# EAGLE design MCO_controller_V5 (EAGLE 7.1.0)
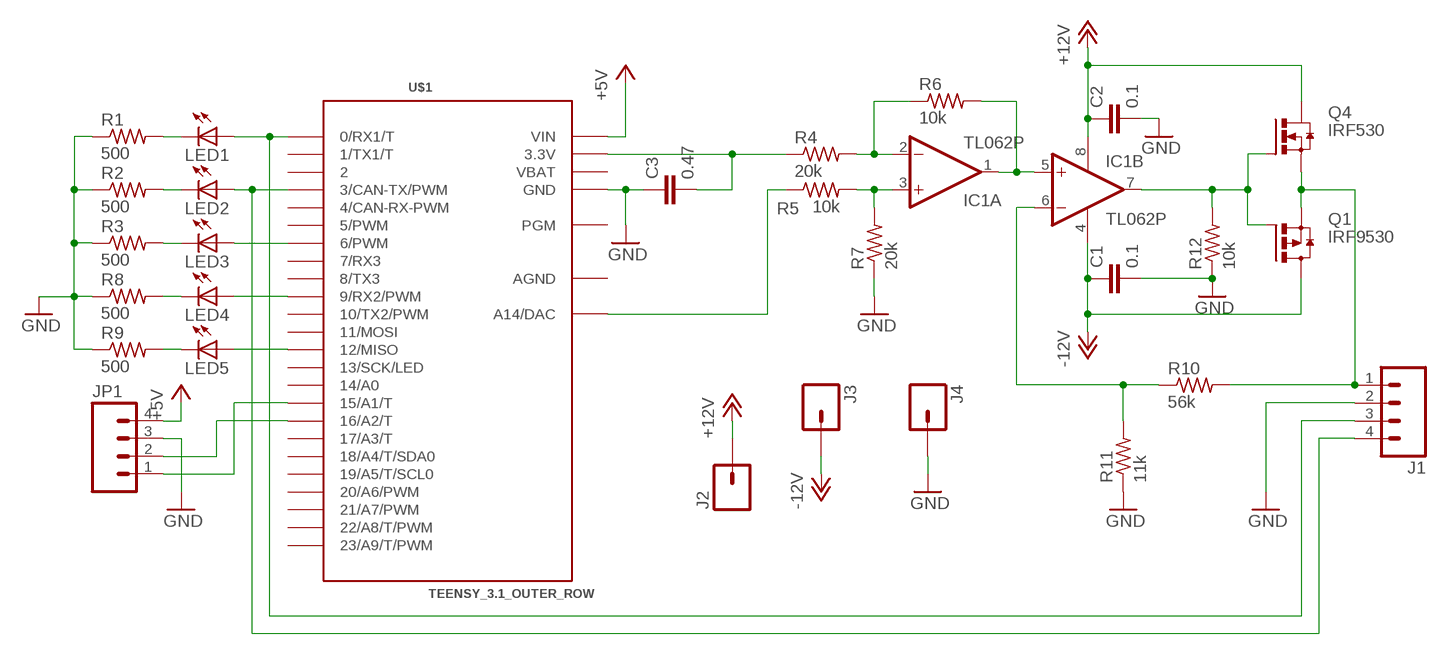
[diagram p0: schematic, sheet 1]

## Parts
C1  0.1  CAPPTH  [CAP-PTH-SMALL]
C2  0.1  CAPPTH  [CAP-PTH-SMALL]
C3  0.47  CAPPTH1  [CAP-PTH-5MM]
IC1  TL062P  [DIL08]
J1  M04SCREW  [SCREWTERMINAL-3.5MM-4]
J2  M01PTH_LONGPAD  [1X01_LONGPAD]
J3  M01PTH_LONGPAD  [1X01_LONGPAD]
J4  M01PTH_LONGPAD  [1X01_LONGPAD]
JP1  M04SCREW  [SCREWTERMINAL-3.5MM-4]
LED1  LED5MM  [LED5MM]
LED2  LED5MM  [LED5MM]
LED3  LED5MM  [LED5MM]
LED4  LED5MM  [LED5MM]
LED5  LED5MM  [LED5MM]
Q1  IRF9530  [TO220AV]
Q4  IRF530  [TO220AV]
R1  500  R-US_0207/10  [0207/10]
R2  500  R-US_0207/10  [0207/10]
R3  500  R-US_0207/10  [0207/10]
R4  20k  R-US_0207/10  [0207/10]
R5  10k  R-US_0207/10  [0207/10]
R6  10k  R-US_0207/10  [0207/10]
R7  20k  R-US_0207/10  [0207/10]
R8  500  R-US_0207/10  [0207/10]
R9  500  R-US_0207/10  [0207/10]
R10  56k  R-US_0207/10  [0207/10]
R11  11k  R-US_0207/10  [0207/10]
R12  10k  R-US_0207/10  [0207/10]
U$1  TEENSY_3.1_OUTER_ROW  [TEENSY3-OUTER_ROW]

## Nets
+5V: JP1.4 U$1.VIN
+12V: C2.1 IC1.8(P:V+) J2.1 Q4.C(D)
-12V: C1.1 IC1.4(P:V-) J3.1 Q1.C(D)
GND: C1.2 C2.2 C3.1 J1.2 J4.1 JP1.3 R1.1 R2.1 R3.1 R7.1 R8.1 R9.1 R11.1 R12.1 U$1.GND U$1.GND1(GND)
N$1: IC1.1(A:OUT) IC1.5(B:+IN) R6.2
N$2: IC1.2(A:-IN) R4.2 R6.1
N$3: IC1.3(A:+IN) R5.2 R7.2
N$4: C3.2 R4.1 U$1.3.3V U$1.3.3V1(3.3V)
N$5: IC1.7(B:OUT) Q1.B(G) Q4.B(G) R12.2
N$7: JP1.1 U$1.15/A1(15/A1/T)
N$8: R5.1 U$1.RESET/DAC(A14/DAC)
N$9: LED4.A U$1.9(9/RX2/PWM)
N$10: JP1.2 U$1.16/A2(16/A2/T)
N$11: LED1.K(C) R1.2
N$12: LED2.K(C) R2.2
N$13: LED3.K(C) R3.2
N$14: J1.4 LED2.A U$1.3(3/CAN-TX/PWM)
N$15: J1.3 LED1.A U$1.0(0/RX1/T)
N$16: LED3.A U$1.6(6/PWM)
N$17: LED4.K(C) R8.2
N$21: LED5.A U$1.12(12/MISO)
N$22: LED5.K(C) R9.2
N$23: J1.1 Q1.E(S) Q4.E(S) R10.2
N$24: IC1.6(B:-IN) R10.1 R11.2
Unconnected: U$1.1(1/TX1/T) U$1.2 U$1.4(4/CAN-RX-PWM) U$1.5(5/PWM) U$1.7(7/RX3) U$1.8(8/TX3) U$1.10(10/TX2/PWM) U$1.11(11/MOSI) U$1.13(13/SCK/LED) U$1.14/A0 U$1.17/A3(17/A3/T) U$1.18/A4(18/A4/T/SDA0) U$1.19/A5(19/A5/T/SCL0) U$1.20/A6(20/A6/PWM) U$1.21/A7(21/A7/PWM) U$1.22/A8(22/A8/T/PWM) U$1.23/A9(23/A9/T/PWM) U$1.PGM

## Power pins joined to a net without a drawn wire
AGND: U$1.AGND
VBAT: U$1.VBAT

## Library data of the parts
C1-C3 = SparkFun:CAP: Capacitor Standard 0603 ceramic capacitor, and 0.1" leaded capacitor.
IC1 = linear:TL062: OP AMP
J1 = SparkFun-Connectors:M04: Header 4 Standard 4-pin 0.1" header. Use with straight break away headers (SKU : PRT-00116), right angle break away headers (PRT-00553), swiss pins (PRT-00743), machine pins (PRT-00117), and female headers (PRT-00115). Molex polarized connector foot print use with SKU : PRT-08231 with associated ...
J2-J4 = SparkFun-Connectors:M01: Header 1 Standard 1-pin 0.1" header. Use with straight break away headers (SKU : PRT-00116), right angle break away headers (PRT-00553), swiss pins (PRT-00743), machine pins (PRT-00117), and female headers (PRT-00115).
JP1 = SparkFun:M04: Header 4 Standard 4-pin 0.1" header. Use with straight break away headers (SKU : PRT-00116), right angle break away headers (PRT-00553), swiss pins (PRT-00743), machine pins (PRT-00117), and female headers (PRT-00115). Molex polarized connector foot print use with SKU : PRT-08231 with associated ...
LED1-LED5 = adafruit:LED: LED OSRAM: - CHIPLED LG R971, LG N971, LY N971, LG Q971, LY Q971, LO R971, LY R971 LH N974, LH R974 LS Q976, LO Q976, LY Q976 LO Q996 - Hyper CHIPLED LW Q18S LB Q993, LB Q99A, LB R99A - SideLED LS A670, LO A670, LY A670, LG A670, LP A670 LB A673, LV A673, LT A673, LW A673 LH A674 LY A675 LS A676, LA A676, LO A676, LY A676, LW A676 LS A679, LY A679, LG A679 - Hyper Micro SIDELED® LS Y876, LA Y876, LO Y876, LY Y876 LT Y87S - SmartLED LW L88C, LW L88S LB L89C, LB L89S, LG L890 LS L89K, LO L89K, LY L89K LS L896, LA L896, LO L896, LY L896 - TOPLED LS T670, LO T670, LY T670, LG T670, LP T670 LSG T670, LSP T670, LSY T670, LOP T670, LYG T670 LG T671, LOG T671, LSG T671 LB T673, LV T673, LT T673, LW T673 LH T674 LS T676, LA T676, LO T676, LY T676, LB T676, LH T676, LSB T676, LW T676 LB T67C, LV T67C, LT T67C, LS T67K, LO T67K, LY T67K, LW E67C LS E67B, LA E67B, LO E67B, LY E67B, LB E67C, LV E67C, LT E67C LW T67C LS T679, LY T679, LG T679 LS T770, LO T770, LY T770, LG T770, LP T770 LB T773, LV T773, LT T773, LW T773 LH T774 LS E675, LA E675, LY E675, LS T675 LS T776, LA T776, LO T776, LY T776, LB T776 LHGB T686 LT T68C, LB T68C - Hyper Mini TOPLED® LB M676 - Mini TOPLED Santana® LG M470 LS M47K, LO M47K, LY M47K Source: http://www.osram.convergy.de/
Q1 = Ayars:IRF9530
Q4 = Ayars:IRF530
R1-R12 = resistor:R-US_: RESISTOR, American symbol
U$1 = Teensy_3_and_LC_Series_Boards_v1.0:TEENSY_3.1_OUTER_ROW: Footprint for Teensy 3.1 or 3.2 board using all pin connections on the outer perimeter

## Board
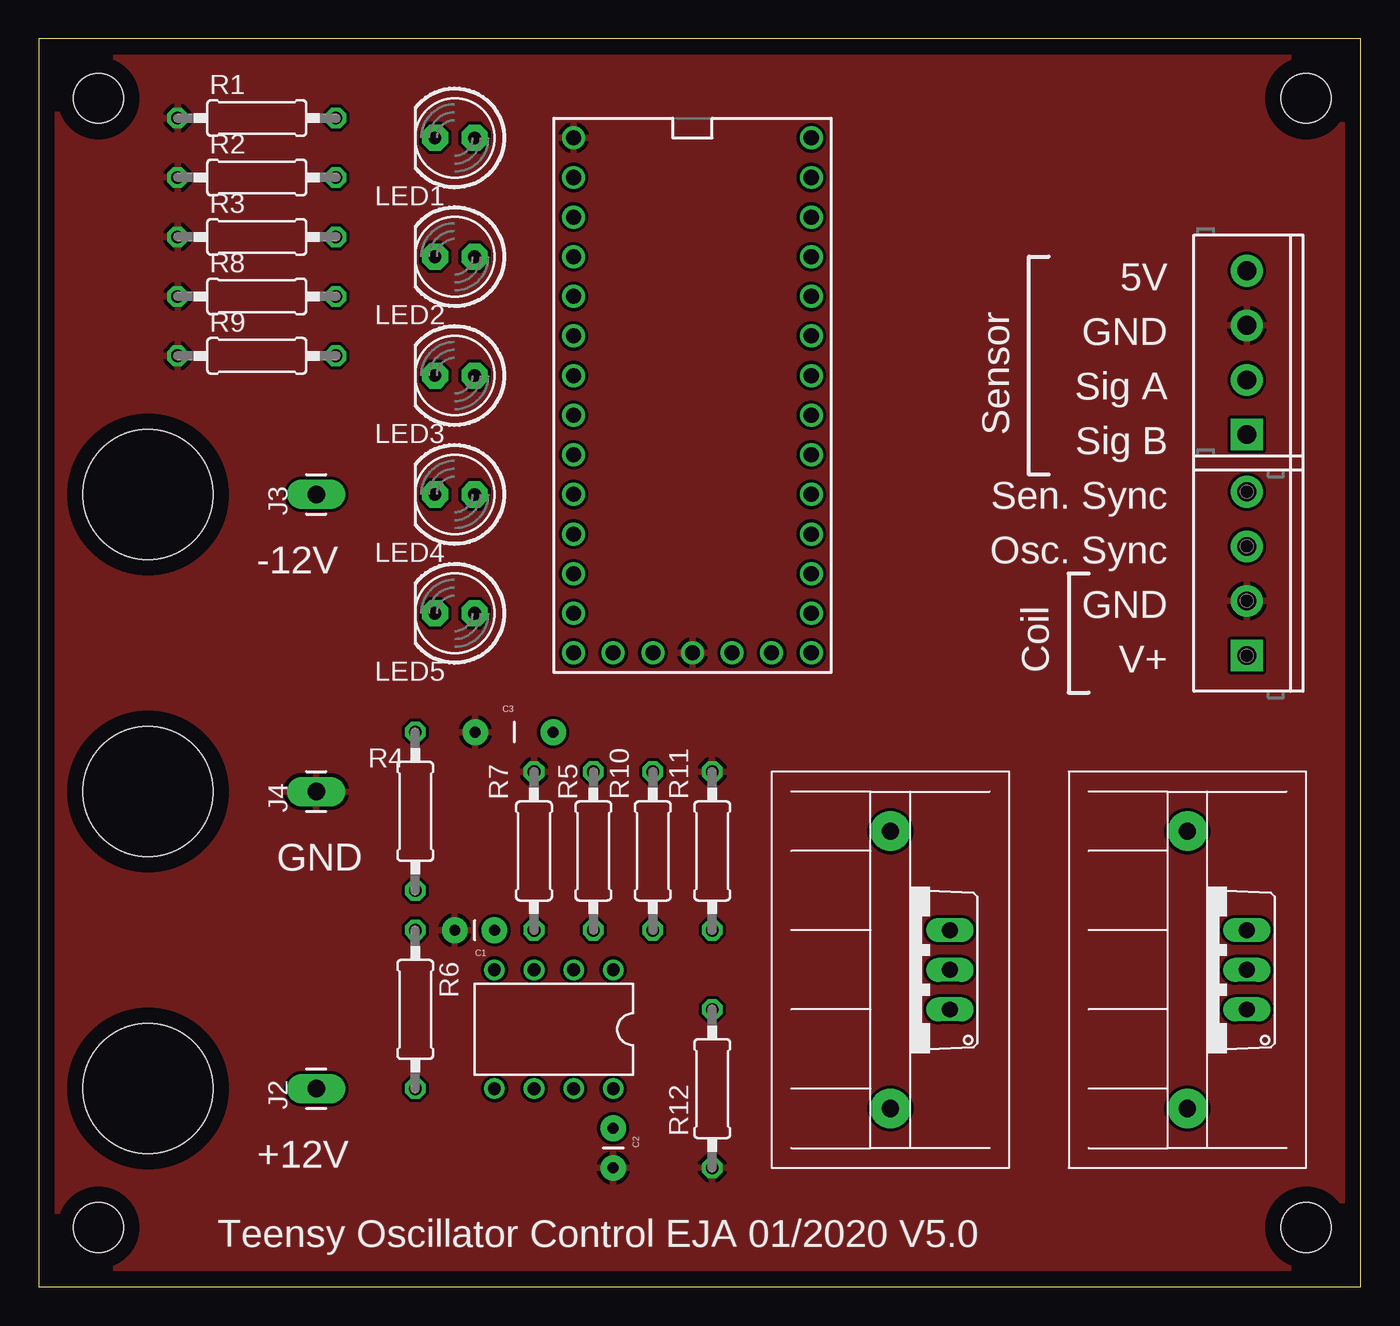
[diagram p1: board, top side]
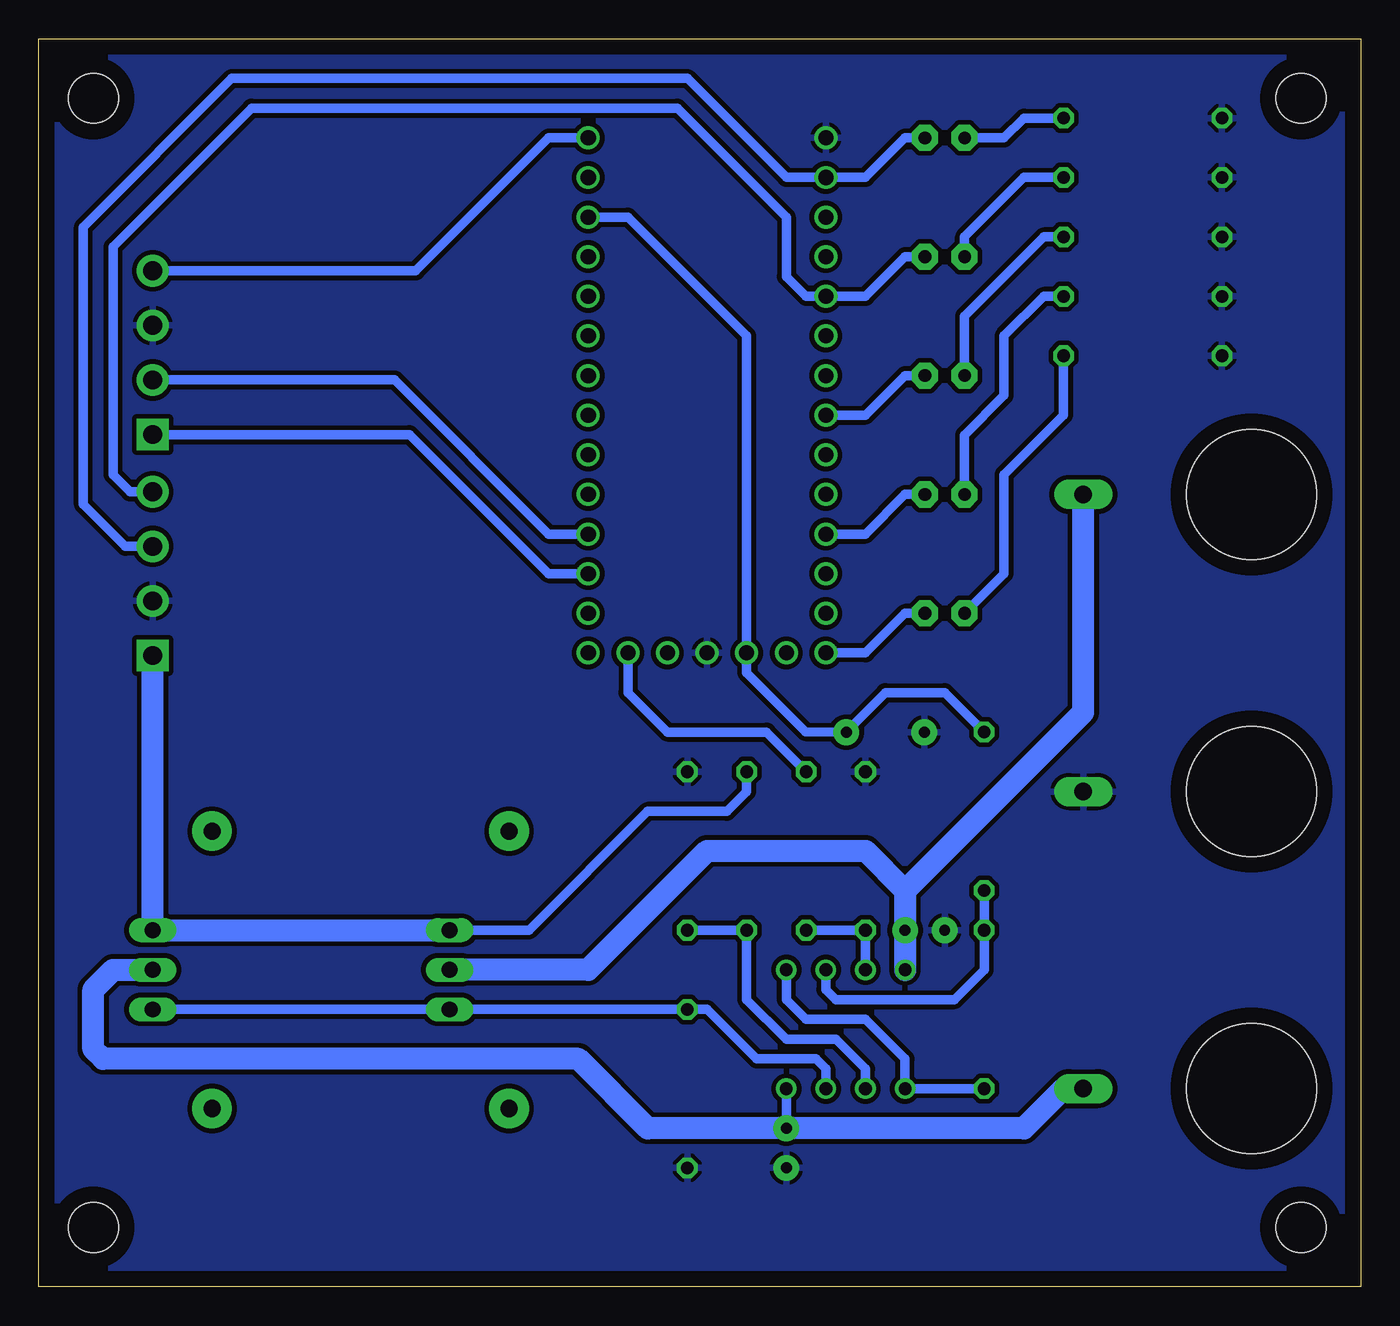
[diagram p2: board, bottom side, seen from below]

Size 84.76 x 80 mm. Coordinates in mm from the lower left corner, seen from the top.
Outline: 0,0 84.76,0 84.76,80 0,80 0,0
Copper layers (1*16): Top 0.035mm / dielectric 1.5mm / Bottom 0.035mm
Design rules "default": minimum track width 10mil, minimum drill 24mil, track to track 8mil, track to pad 8mil, pad to pad 8mil, via to via 8mil, smd to smd 8mil, copper to edge 40mil, drill to drill 8mil, minimum pad ring 10mil, minimum via ring 8mil, stop-mask expansion 4mil, vias tented up to drill 0mil, thermal gap 10mil
Holes 3.2 mm at 3.81,3.81 81.28,3.81 81.28,76.2 3.81,76.2
Holes 8.33 mm at 6.99,12.7 6.99,31.75 6.99,50.8

### Footprints (pad centres in the part's own frame; a part is rotated, then mirrored left to right if it is on the bottom)
CAP-PTH-SMALL = drill 0.7 pad 1.651: 1 0,0; 2 2.54,0
CAP-PTH-5MM = drill 0.7 pad 1.651: 1 -2.5,0; 2 2.5,0
DIL08 = drill 0.813 pad 1.27: 1 -3.81,-3.81; 2 -1.27,-3.81; 3 1.27,-3.81; 4 3.81,-3.81; 5 3.81,3.81; 6 1.27,3.81; 7 -1.27,3.81; 8 -3.81,3.81
SCREWTERMINAL-3.5MM-4 = drill 1.2 pad 2.032 square: 1 0,0 | drill 1.2 pad 2.032: 2 3.5,0; 3 7,0; 4 10.5,0
1X01_LONGPAD = drill 1.118 pad 1.88 long: 1 0,0
LED5MM = drill 0.813 pad 1.676 octagon: A -1.27,0; K 1.27,0
TO220AV = drill 1.016 long: B -2.54,-3.81; C 0,-3.81; E 2.54,-3.81 | drill 1.1 pad 2.54: P$1 -8.89,0; P$2 8.89,0
0207/10 = drill 0.813 octagon: 1 -5.08,0; 2 5.08,0
TEENSY3-OUTER_ROW = drill 0.965: 0 -7.62,13.97; 1 -7.62,11.43; 2 -7.62,8.89; 3 -7.62,6.35; 3.3V 7.62,11.43; 3.3V1 -2.54,-16.51; 4 -7.62,3.81; 5 -7.62,1.27; 6 -7.62,-1.27; 7 -7.62,-3.81; 8 -7.62,-6.35; 9 -7.62,-8.89; 10 -7.62,-11.43; 11 -7.62,-13.97; 12 -7.62,-16.51; 13 7.62,-16.51; 14/A0 7.62,-13.97; 15/A1 7.62,-11.43; 16/A2 7.62,-8.89; 17/A3 7.62,-6.35; 18/A4 7.62,-3.81; 19/A5 7.62,-1.27; 20/A6 7.62,1.27; 21/A7 7.62,3.81; 22/A8 7.62,6.35; 23/A9 7.62,8.89; AGND 7.62,13.97; GND -7.62,16.51; GND1 0,-16.51; PGM 2.54,-16.51; RESET/DAC 5.08,-16.51; VBAT -5.08,-16.51; VIN 7.62,16.51

### Placement (x,y rotation side)
C1  29.21,22.86 180 top
C2  36.83,10.16 270 top
C3  30.48,35.56 0 top
IC1  33.02,16.51 180 top
J1  77.47,40.47 90 top
J2  17.78,12.7 90 top
J3  17.78,50.8 90 top
J4  17.78,31.75 90 top
JP1  77.47,54.64 90 top
LED1  26.67,73.66 180 top
LED2  26.67,66.04 180 top
LED3  26.67,58.42 180 top
LED4  26.67,50.8 180 top
LED5  26.67,43.18 180 top
Q1  54.61,20.32 90 top
Q4  73.66,20.32 90 top
R1  13.97,74.93 0 top
R2  13.97,71.12 0 top
R3  13.97,67.31 0 top
R4  24.13,30.48 270 top
R5  35.56,27.94 270 top
R6  24.13,17.78 270 top
R7  31.75,27.94 270 top
R8  13.97,63.5 0 top
R9  13.97,59.69 0 top
R10  39.37,27.94 90 top
R11  43.18,27.94 270 top
R12  43.18,12.7 90 top
U$1  41.91,57.15 0 top

### Tracks (layer width: path | path; a pad name or v marks a point on that pad's centre or on a via)
+5V
  Bottom 0.61: JP1.4 60.59,65.14 52.07,73.66 U$1.VIN
+12V
  Bottom 0.61: IC1.8 C2.1
  Bottom 1.422: J2.1 19.05,12.7 21.59,10.16 C2.1 45.72,10.16 50.16,14.61 80.64,14.61 81.28,15.24 81.28,19.05 80.01,20.32 Q4.C
-12V
  Bottom 1.422: Q1.C 49.53,20.32 41.91,27.94 31.75,27.94 29.21,25.4 | 29.21,25.4 17.78,36.83 J3.1 | 29.21,25.4 C1.1 IC1.4
GND
  pour Bottom (isolate 0.305): 0,0 85.09,0 85.09,80.01 0,80.01
  pour Top: 0,80.01 85.09,80.01 85.09,0 0,0
N$1
  Bottom 0.61: R6.2 IC1.5 29.21,14.61 31.75,17.14 35.56,17.14 36.83,18.41 IC1.1
N$2
  Bottom 0.61: IC1.2 34.29,19.05 33.66,18.41 26.04,18.41 24.13,20.32 R4.2 R6.1
N$3
  Bottom 0.61: IC1.3 R7.2 R5.2
N$4
  Bottom 0.61: U$1.3.3V 46.99,68.58 39.37,60.96 U$1.3.3V1 39.37,39.37 35.6,35.6 35.56,35.6 C3.2 32.98,35.6 30.48,38.1 26.67,38.1 R4.1
N$5
  Bottom 0.61: IC1.7 34.29,13.97 34.92,14.61 38.73,14.61 41.91,17.78 R12.2 Q1.B Q4.B
N$7
  Bottom 0.61: JP1.1 60.99,54.64 52.07,45.72 U$1.15/A1
N$8
  Bottom 0.61: U$1.RESET/DAC 46.99,38.1 44.45,35.56 38.1,35.56 R5.1
N$9
  Bottom 0.61: U$1.9 31.75,48.26 29.21,50.8 LED4.A
N$10
  Bottom 0.61: JP1.2 61.95,58.14 52.07,48.26 U$1.16/A2
N$11
  Bottom 0.61: LED1.K 22.86,73.66 21.59,74.93 R1.2
N$12
  Bottom 0.61: LED2.K 25.4,67.31 21.59,71.12 20.32,71.12 R2.2
N$13
  Bottom 0.61: R3.2 20.32,67.31 25.4,62.23 LED3.K
N$14
  Bottom 0.61: J1.4 78.91,50.97 80.01,52.07 80.01,66.67 71.12,75.56 43.81,75.56 36.83,68.58 36.83,64.77 35.56,63.5 U$1.3 31.75,63.5 29.21,66.04 LED2.A
N$15
  Bottom 0.61: J1.3 79.22,47.47 81.92,50.16 81.92,67.94 72.39,77.47 43.18,77.47 36.83,71.12 U$1.0 31.75,71.12 29.21,73.66 LED1.A
N$16
  Bottom 0.61: U$1.6 31.75,55.88 29.21,58.42 LED3.A
N$17
  Bottom 0.61: R8.2 20.32,63.5 22.86,60.96 22.86,57.15 25.4,54.61 LED4.K
N$21
  Bottom 0.61: LED5.A 29.21,43.18 31.75,40.64 U$1.12
N$22
  Bottom 0.61: R9.2 19.05,55.88 22.86,52.07 22.86,45.72 LED5.K
N$23
  Bottom 0.61: R10.2 39.37,31.75 40.64,30.48 45.72,30.48 53.34,22.86 Q1.E
  Bottom 1.422: Q1.E Q4.E J1.1
N$24
  Bottom 0.61: IC1.6 31.75,13.97 33.66,15.88 36.83,15.88 39.37,18.41 R10.1 R11.2

### Text on the board
_tsilk: 5V | GND | Sig A | Sensor | Sig B | Sen. Sync | -12V | Osc. Sync | GND | Coil | V+ | GND | +12V | Teensy Oscillator Control EJA 01/2020 V5.0